# EAGLE board Strampler_redesign_v2_2 (EAGLE 7.3.0)
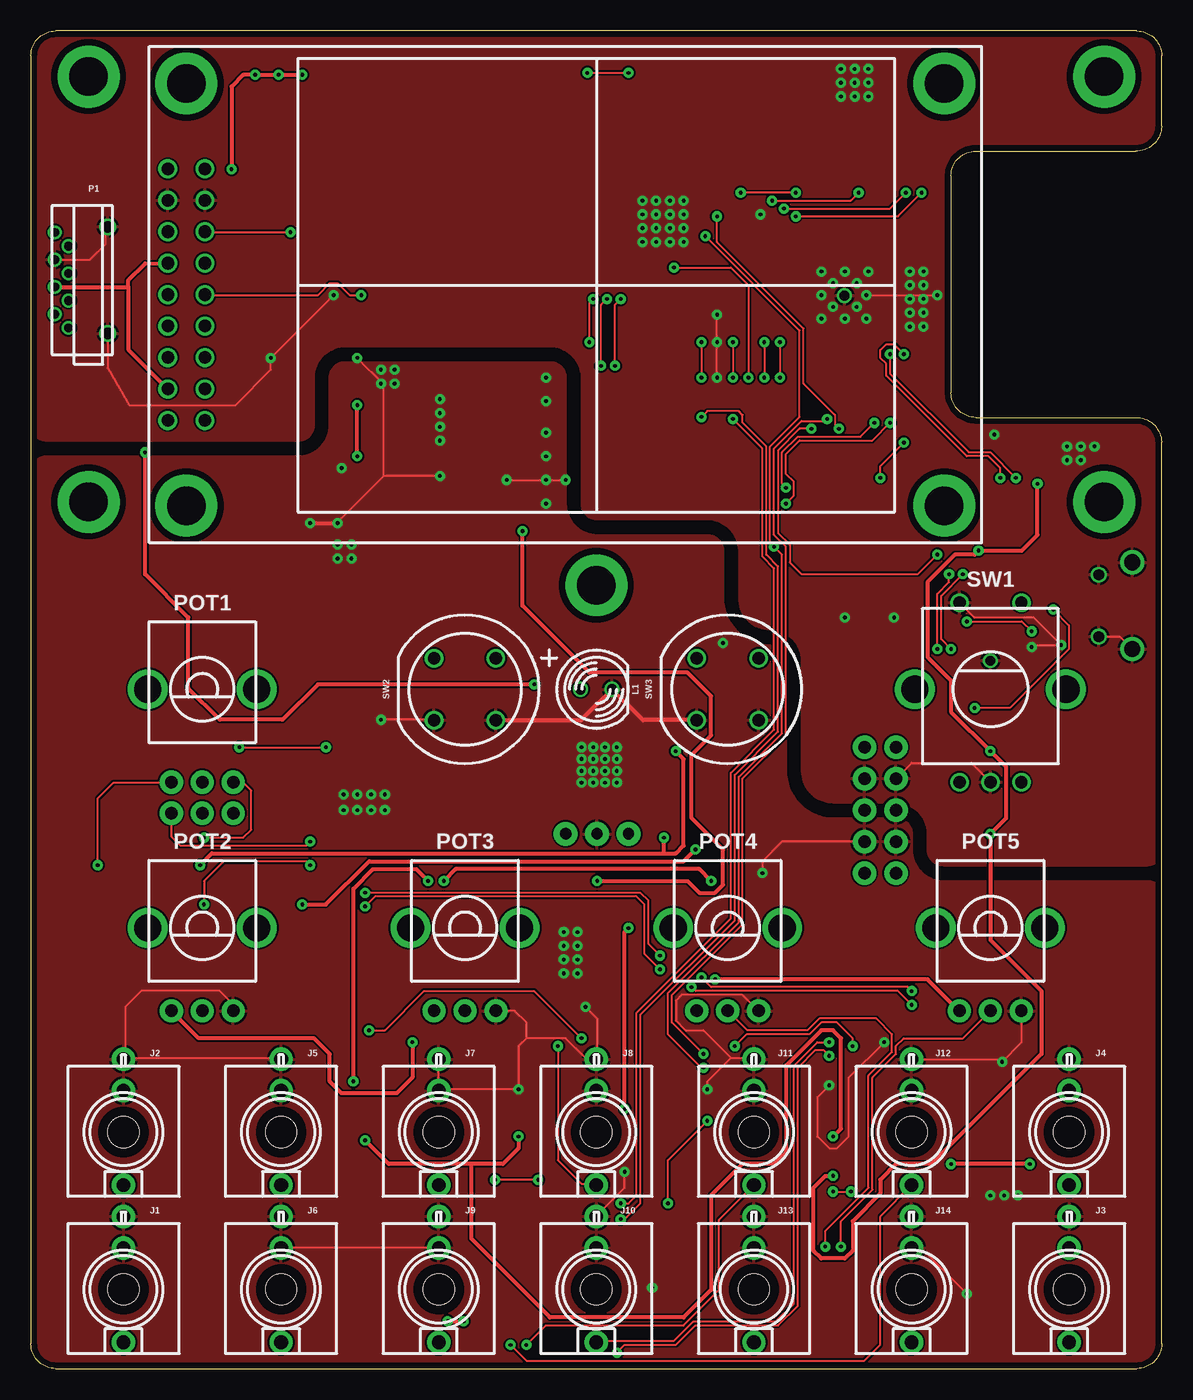
[diagram p2: board, top side]
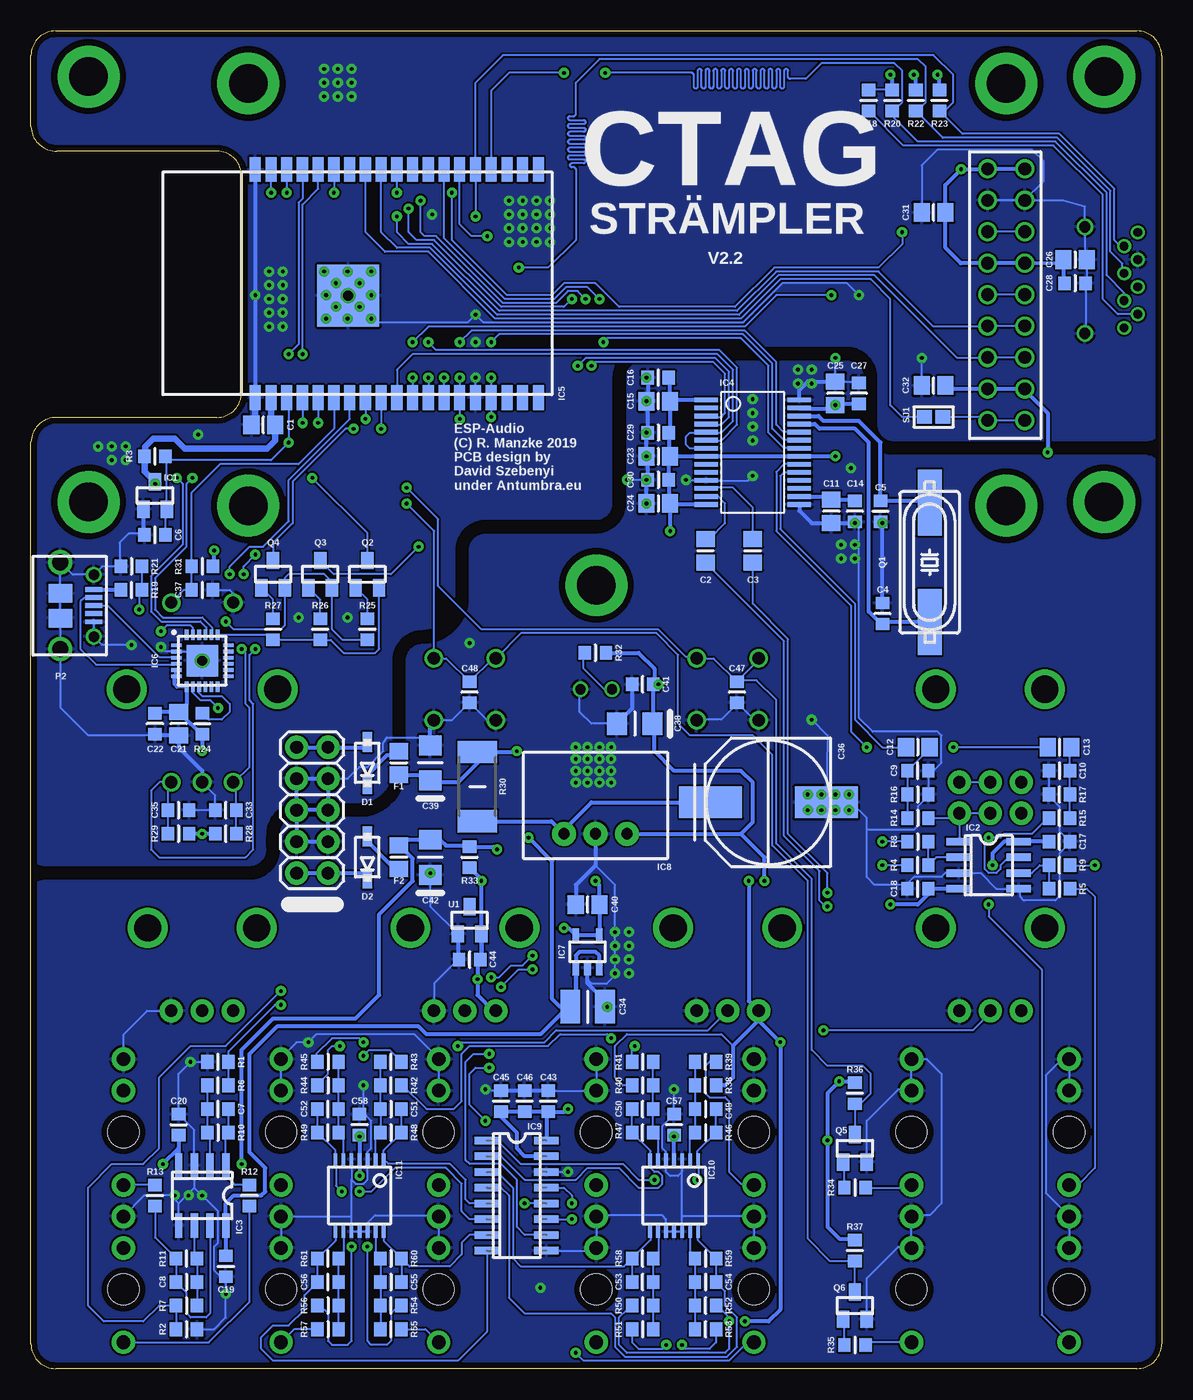
[diagram p3: board, bottom side, seen from below]

Size 91.3 x 108 mm. Coordinates in mm from the lower left corner, seen from the top.
Outline: 2,0 89.3,0 arc90 91.3,2 91.3,74.8 arc90 89.2,76.8 76.3,76.8 arc-90 74.3,78.8 74.3,96.3 arc-90 76.3,98.3 89.2,98.3 arc90 91.3,100.3 91.3,106 arc90 89.3,108 2,108 arc90 0,106 0,2 arc90 2,0
Copper layers (1*16): Top 0.035mm / dielectric 1.5mm / Bottom 0.035mm
Design rules "PCBCart-Standard *": minimum track width 6mil, minimum drill 12mil, track to track 6mil, track to pad 6mil, pad to pad 6mil, via to via 6mil, smd to smd 6mil, copper to edge 20mil, drill to drill 8mil, minimum pad ring 8mil, minimum via ring 10mil, stop-mask expansion 3mil, vias tented up to drill 25mil, thermal gap 8mil

## Footprints (pad centres in the part's own frame; a part is rotated, then mirrored left to right if it is on the bottom)
R0805 = smd 1.3 x 1.5: 1 -0.95,0; 2 0.95,0
RESISTOR_0603 = smd 1 x 1.1: 1 -0.85,0; 2 0.85,0
R1210 = smd 1.6 x 2.7: 1 -1.4,0; 2 1.4,0
PANASONIC_G = smd 5.08 x 2.54: + 4.678,0; - -4.678,0
1206_POL = smd 1.6 x 1.803: 1 -1.422,0; 2 1.422,0
SOD123 = smd 1.6 x 0.8: + 1.7,0; - -1.7,0
PCB_SCREW = drill 3.1 pad 5: P$1 0,0
SOT23 = smd 1 x 1.4: 1 -0.95,-1.1; 2 0.95,-1.1; 3 0,1.1
SOIC8 = smd 0.6 x 2: 1 -1.905,-2.419; 2 -0.635,-2.419; 3 0.635,-2.419; 4 1.905,-2.419; 5 1.905,2.42; 6 0.635,2.42; 7 -0.635,2.42; 8 -1.905,2.42
SSOP28 = smd 0.381 x 1.905: 1 -4.55,-3.752; 2 -3.9,-3.752; 3 -3.25,-3.752; 4 -2.6,-3.752; 5 -1.95,-3.752; 6 -1.3,-3.752; 7 -0.65,-3.752; 8 0,-3.752; 9 0.65,-3.752; 10 1.3,-3.752; 11 1.95,-3.752; 12 2.6,-3.752; 13 3.25,-3.752; 14 3.9,-3.752; 15 3.9,3.752; 16 3.25,3.752; 17 2.6,3.752; 18 1.95,3.752; 19 1.3,3.752; 20 0.65,3.752; 21 0,3.752; 22 -0.65,3.752; 23 -1.3,3.752; 24 -1.95,3.752; 25 -2.6,3.752; 26 -3.25,3.752; 27 -3.9,3.752; 28 -4.55,3.752
ESP32-WROVER-B = smd 5 x 5: GND -1,0.76 | drill 0.8: GND2 -1,0.76 | smd 2 x 0.9: P$1 -9.235,8.26; P$2 -9.235,6.99; P$3 -9.235,5.72; P$4 -9.235,4.45; P$5 -9.235,3.18; P$6 -9.235,1.91; P$7 -9.235,0.64; P$8 -9.235,-0.63; P$9 -9.235,-1.9; P$10 -9.235,-3.17; P$11 -9.235,-4.44; P$12 -9.235,-5.71; P$13 -9.235,-6.98; P$14 -9.235,-8.25; P$15 -9.235,-9.52; P$16 -9.235,-10.79; P$17 -9.235,-12.06; P$18 -9.235,-13.33; P$19 -9.235,-14.6; P$20 9.18,-14.6; P$21 9.18,-13.33; P$22 9.18,-12.06; P$23 9.18,-10.79; P$24 9.18,-9.52; P$25 9.18,-8.25; P$26 9.18,-6.98; P$27 9.18,-5.71; P$28 9.18,-4.44; P$29 9.18,-3.17; P$30 9.18,-1.9; P$31 9.18,-0.63; P$32 9.18,0.64; P$33 9.18,1.91; P$34 9.18,3.18; P$35 9.18,4.45; P$36 9.18,5.72; P$37 9.18,6.99; P$38 9.18,8.26
CP2102N = smd 2.55 x 2.55: GND 0,0 | drill 0.8: GND2 0,0 | smd 0.85 x 0.3: P$1 -2.1,1.25; P$2 -2.1,0.75; P$3 -2.1,0.25; P$4 -2.1,-0.25; P$5 -2.1,-0.75; P$6 -2.1,-1.25; P$13 2.1,-1.25; P$14 2.1,-0.75; P$15 2.1,-0.25; P$16 2.1,0.25; P$17 2.1,0.75; P$18 2.1,1.25 | smd 0.3 x 0.85: P$7 -1.25,-2.1; P$8 -0.75,-2.1; P$9 -0.25,-2.1; P$10 0.25,-2.1; P$11 0.75,-2.1; P$12 1.25,-2.1; P$19 1.25,2.1; P$20 0.75,2.1; P$21 0.25,2.1; P$22 -0.25,2.1; P$23 -0.75,2.1; P$24 -1.25,2.1
SOT23-5L = smd 0.55 x 1.2: 1 -0.95,-1.3; 2 0,-1.3; 3 0.95,-1.3; 4 0.95,1.3; 5 -0.95,1.3
WE78 = drill 0.9 pad 1.93: 1 -2.54,0; 2 0,0; 3 2.54,0
SOIC16 = smd 2 x 0.6: 1 -2.419,4.445; 2 -2.419,3.175; 3 -2.419,1.905; 4 -2.419,0.635; 5 -2.419,-0.635; 6 -2.419,-1.905; 7 -2.419,-3.175; 8 -2.419,-4.445; 9 2.381,-4.445; 10 2.381,-3.175; 11 2.381,-1.905; 12 2.381,-0.635; 13 2.381,0.635; 14 2.381,1.905; 15 2.381,3.175; 16 2.381,4.445
TSSOP14 = smd 0.305 x 0.991: 1 -1.95,-2.918; 2 -1.3,-2.918; 3 -0.65,-2.918; 4 0,-2.918; 5 0.65,-2.918; 6 1.3,-2.918; 7 1.95,-2.918; 8 1.95,2.918; 9 1.3,2.918; 10 0.65,2.918; 11 0,2.918; 12 -0.65,2.918; 13 -1.3,2.918; 14 -1.95,2.918
PROTOJACK = drill 1.1 pad 1.88: GND 0,-5.88; IN 0,4.28; NORM 0,-3.34 | hole 2.5: 0,0
LED_5MM = drill 0.813: A -1.27,0; K 1.27,0
SD-CARD-THONK = drill 0.7: P$1 -3.85,0.47; P$2 -2.75,1.57; P$3 -1.65,0.47; P$4 -0.55,1.57; P$5 0.55,0.47; P$6 1.65,1.57; P$7 2.75,0.47; P$8 3.85,1.57 | drill 0.9: P$9 -4.3,-2.7; P$10 4.3,-2.7
USB-B-MOLEX-1050170001 = smd 0.4 x 1.35: P1 -1.3,0; P2 -0.65,0; P3 0,0; P4 0.65,0; P5 1.3,0 | drill 0.85: P$1 -2.5,0; P$2 2.5,0 | drill 1.3: P$8 3.5,-2.7; P$9 -3.5,-2.7 | smd 1.5 x 1.9: P$10 -1,-2.7; P$11 1,-2.7
MSP2202_DISPLAY = drill 1.016: CS -34.6,4.33; CS1 -31.6,4.33; DC/RS -34.6,-0.75; DC/RS1 -31.6,-0.75; GND -34.6,6.87; GND1 -31.6,6.87; LED -34.6,-8.37; LED1 -31.6,-8.37; RESET -34.6,1.79; RESET1 -31.6,1.79; SCK -34.6,-5.83; SCK1 -31.6,-5.83; SDD/MISO -34.6,-10.91; SDD/MISO1 -31.6,-10.91; SDI/MOSI -34.6,-3.29; SDI/MOSI1 -31.6,-3.29; VCC -34.6,9.41; VCC1 -31.6,9.41 | drill 3.1 pad 5: P$1 -33.1,-17.8; P$2 -33.1,16.3; P$3 28.1,16.3; P$4 28.1,-17.8
POWER_10 = drill 1.016 pad 1.88: 1 -5.08,-1.27; 2 -5.08,1.27; 3 -2.54,-1.27; 4 -2.54,1.27; 5 0,-1.27; 6 0,1.27; 7 2.54,-1.27; 8 2.54,1.27; 9 5.08,-1.27; 10 5.08,1.27
POT_DUAL_THONK = drill 2.2 pad 3.175: P$4 4.4,0; P$5 -4.4,0 | drill 1 pad 1.88: R1_1 -2.5,-10; R1_2 0,-10; R1_3 2.5,-10; R2_1 -2.5,-7.5; R2_2 0,-7.5; R2_3 2.5,-7.5
ALPS_POT_VERTICAL = drill 1 pad 1.88: 1 -2.5,-6.7; 2 0,-6.7; 3 2.5,-6.7 | drill 2.2 pad 3.175: P$4 4.4,0; P$5 -4.4,0
HC49UP = smd 5.334 x 1.93: 1 -4.826,0; 2 4.826,0
R2512 = smd 1.8 x 3.2: 1 -2.8,0; 2 2.8,0
SJ = smd 1.2 x 1.1: 1 -0.75,0; 2 0.75,0
ALPS_EC12E_SW = drill 1: A -2.5,-7.5; B 2.5,-7.5; C 0,-7.5; D -2.5,7; E 2.5,7 | drill 2.2: GND1 -6.1,0; GND2 6.1,0
C&K_TACTILE_SWITCH = drill 1: P$1 -2.5,2.5; P$2 2.5,2.5; P$3 -2.5,-2.5; P$4 2.5,-2.5

## Placement (x,y rotation side)
C1  10uF  [R0805]  72.55,76.2 180 bottom
C2  10uF  [R0805]  36.83,66.04 90 bottom
C3  10uF  [R0805]  33.02,66.04 90 bottom
C4  18pF  [RESISTOR_0603]  22.54,60.96 270 bottom
C5  18pF  [RESISTOR_0603]  22.7,69.22 90 bottom
C6  1uF  [RESISTOR_0603]  81.28,67.31 180 bottom
C7  18pF  [RESISTOR_0603]  76.2,20.95 180 bottom
C8  18pF  [RESISTOR_0603]  78.74,6.99 0 bottom
C9  220pF  [RESISTOR_0603]  19.68,48.26 180 bottom
C10  220pF  [RESISTOR_0603]  8.26,48.26 0 bottom
C11  10uF  [R0805]  26.67,69.22 270 bottom
C12  10uF  [R0805]  19.68,50.16 0 bottom
C13  10uF  [R0805]  8.26,50.16 0 bottom
C14  100nF  [RESISTOR_0603]  24.77,69.22 270 bottom
C15  10uF  [R0805]  40.64,78.11 180 bottom
C16  100nF  [RESISTOR_0603]  40.64,80.01 180 bottom
C17  100nF  [RESISTOR_0603]  8.26,42.55 180 bottom
C18  100nF  [RESISTOR_0603]  19.68,38.73 180 bottom
C19  100nF  [RESISTOR_0603]  75.56,8.26 90 bottom
C20  100nF  [RESISTOR_0603]  79.38,19.68 90 bottom
C21  10uF  [R0805]  79.38,52.07 270 bottom
C22  100nF  [RESISTOR_0603]  81.28,52.07 270 bottom
C23  10uF  [R0805]  40.64,73.66 0 bottom
C24  10uF  [R0805]  40.64,69.85 0 bottom
C25  10uF  [R0805]  26.35,78.74 270 bottom
C26  10uF  [R0805]  6.99,89.53 0 bottom
C27  100nF  [RESISTOR_0603]  24.45,78.74 270 bottom
C28  100nF  [RESISTOR_0603]  6.99,87.63 0 bottom
C29  100nF  [RESISTOR_0603]  40.64,75.56 0 bottom
C30  100nF  [RESISTOR_0603]  40.64,71.75 0 bottom
C31  10uF  [R0805]  18.41,93.34 180 bottom
C32  10uF  [R0805]  18.41,79.38 180 bottom
C33  100nF  [RESISTOR_0603]  75.56,45.09 180 bottom
C34  10uF  [R1210]  46.35,29.21 0 bottom
C35  100nF  [RESISTOR_0603]  79.38,45.09 0 bottom
C36  1000uF  [PANASONIC_G]  31.75,45.72 180 bottom
C37  100nF  [RESISTOR_0603]  77.47,62.87 0 bottom
C38  22uF  [1206_POL]  42.55,52.07 0 bottom
C39  22uF  [1206_POL]  59.05,48.9 270 bottom
C40  10uF  [R0805]  46.35,37.47 180 bottom
C41  100nF  [RESISTOR_0603]  41.91,55.24 180 bottom
C42  22uF  [1206_POL]  59.05,41.27 270 bottom
C43  1uF  [RESISTOR_0603]  49.53,21.59 270 bottom
C44  100nF  [RESISTOR_0603]  55.88,33.02 180 bottom
C45  1uF  [RESISTOR_0603]  53.34,21.59 270 bottom
C46  100nF  [RESISTOR_0603]  51.44,21.59 270 bottom
C47  100nF  [RESISTOR_0603]  34.29,54.61 270 bottom
C48  100nF  [RESISTOR_0603]  55.88,54.61 270 bottom
C49  1nF  [RESISTOR_0603]  36.83,20.95 0 bottom
C50  1nF  [RESISTOR_0603]  41.91,20.95 180 bottom
C51  1nF  [RESISTOR_0603]  62.23,20.95 0 bottom
C52  1nF  [RESISTOR_0603]  67.31,20.95 180 bottom
C53  1nF  [RESISTOR_0603]  41.91,6.99 180 bottom
C54  1nF  [RESISTOR_0603]  36.83,6.99 0 bottom
C55  1nF  [RESISTOR_0603]  62.23,6.99 0 bottom
C56  1nF  [RESISTOR_0603]  67.31,6.99 180 bottom
C57  100nF  [RESISTOR_0603]  39.37,19.68 270 bottom
C58  100nF  [RESISTOR_0603]  64.77,19.68 270 bottom
D1  [SOD123]  64.14,48.9 90 bottom
D2  [SOD123]  64.14,41.27 90 bottom
F1  FERRITE-BEAD0805  [R0805]  61.59,48.9 90 bottom
F2  FERRITE-BEAD0805  [R0805]  61.59,41.27 270 bottom
H1  PCB_SCREW  [PCB_SCREW]  86.65,104.31 0 top
H2  PCB_SCREW  [PCB_SCREW]  45.65,63.24 0 top
H3  PCB_SCREW  [PCB_SCREW]  4.65,69.97 0 top
H4  PCB_SCREW  [PCB_SCREW]  86.65,69.97 0 top
H5  PCB_SCREW  [PCB_SCREW]  4.65,104.31 0 top
IC1  MIC803  [SOT23]  81.28,70.48 0 bottom
IC2  TL072  [SOIC8]  13.97,40.64 270 bottom
IC3  TL072  [SOIC8]  77.47,13.97 180 bottom
IC4  WM8731  [SSOP28]  33.02,73.66 270 bottom
IC5  ESP32-WROVER-B  [ESP32-WROVER-B]  64.93,87.63 90 bottom
IC6  CP2102N  [CP2102N]  77.47,57.15 0 bottom
IC7  ADP7118  [SOT23-5L]  46.35,33.66 0 bottom
IC8  WE173950378  [WE78]  45.72,43.18 0 bottom
IC9  MCP3208  [SOIC16]  52.07,13.97 0 bottom
IC10  MCP6004  [TSSOP14]  39.37,13.97 180 bottom
IC11  MCP6004  [TSSOP14]  64.77,13.97 180 bottom
J1  THONKICONN  [PROTOJACK]  7.47,6.4 180 top
J2  THONKICONN  [PROTOJACK]  7.47,19.1 180 top
J3  THONKICONN  [PROTOJACK]  83.83,6.4 180 top
J4  THONKICONN  [PROTOJACK]  83.83,19.1 180 top
J5  THONKICONN  [PROTOJACK]  20.2,19.1 180 top
J6  THONKICONN  [PROTOJACK]  20.2,6.4 180 top
J7  THONKICONN  [PROTOJACK]  32.92,19.1 180 top
J8  THONKICONN  [PROTOJACK]  45.65,19.1 180 top
J9  THONKICONN  [PROTOJACK]  32.92,6.4 180 top
J10  THONKICONN  [PROTOJACK]  45.65,6.4 180 top
J11  THONKICONN  [PROTOJACK]  58.38,19.1 180 top
J12  THONKICONN  [PROTOJACK]  71.11,19.1 180 top
J13  THONKICONN  [PROTOJACK]  58.38,6.4 180 top
J14  THONKICONN  [PROTOJACK]  71.11,6.4 180 top
L1  LED5MM  [LED_5MM]  45.65,54.85 0 top
P1  SD-CARD  [SD-CARD-THONK]  3.49,87.88 90 top
P2  USB-B  [USB-B-MOLEX-1050170001]  86.22,61.59 270 bottom
P3  MSP2202_DISPLAY  [MSP2202_DISPLAY]  45.65,87.46 0 top
P4  POWER_SIMPLE10  [POWER_10]  68.58,45.09 90 bottom
POT1  [POT_DUAL_THONK]  13.83,54.85 0 top
POT2  [ALPS_POT_VERTICAL]  13.83,35.58 0 top
POT3  [ALPS_POT_VERTICAL]  35.05,35.58 0 top
POT4  [ALPS_POT_VERTICAL]  56.26,35.58 0 top
POT5  [ALPS_POT_VERTICAL]  77.47,35.58 0 top
Q1  [HC49UP]  18.73,65.09 90 bottom
Q2  SS8050-G  [SOT23]  64.14,64.14 0 bottom
Q3  SS8050-G  [SOT23]  67.94,64.14 0 bottom
Q4  SS8050-G  [SOT23]  71.75,64.14 0 bottom
Q5  SS8050-G  [SOT23]  24.77,17.78 0 bottom
Q6  SS8050-G  [SOT23]  24.77,5.08 0 bottom
R1  39k  [RESISTOR_0603]  76.2,24.77 180 bottom
R2  39k  [RESISTOR_0603]  78.74,3.17 0 bottom
R3  10k  [RESISTOR_0603]  81.28,73.66 180 bottom
R4  22k  [RESISTOR_0603]  19.68,40.64 180 bottom
R5  22k  [RESISTOR_0603]  8.26,38.73 0 bottom
R6  5.6k  [RESISTOR_0603]  76.2,22.86 180 bottom
R7  5.6k  [RESISTOR_0603]  78.74,5.08 0 bottom
R8  3.3k  [RESISTOR_0603]  19.68,42.55 0 bottom
R9  3.3k  [RESISTOR_0603]  8.26,40.64 180 bottom
R10  39k  [RESISTOR_0603]  76.2,19.05 0 bottom
R11  39k  [RESISTOR_0603]  78.74,8.89 180 bottom
R12  1k  [RESISTOR_0603]  73.66,13.97 270 bottom
R13  1k  [RESISTOR_0603]  81.28,13.97 90 bottom
R14  5.6k  [RESISTOR_0603]  19.68,44.45 0 bottom
R15  5.6k  [RESISTOR_0603]  8.26,44.45 180 bottom
R16  5.6k  [RESISTOR_0603]  19.68,46.35 0 bottom
R17  5.6k  [RESISTOR_0603]  8.26,46.35 180 bottom
R18  10k  [RESISTOR_0603]  23.65,102.39 90 bottom
R19  22.1k  [RESISTOR_0603]  83.19,62.87 180 bottom
R20  10k  [RESISTOR_0603]  21.75,102.39 90 bottom
R21  47.5k  [RESISTOR_0603]  83.19,64.77 0 bottom
R22  10k  [RESISTOR_0603]  19.84,102.39 90 bottom
R23  10k  [RESISTOR_0603]  17.94,102.39 90 bottom
R24  10k  [RESISTOR_0603]  77.47,52.07 90 bottom
R25  10k  [RESISTOR_0603]  64.14,59.69 270 bottom
R26  10k  [RESISTOR_0603]  67.94,59.69 270 bottom
R27  10k  [RESISTOR_0603]  71.75,59.69 270 bottom
R28  10k  [RESISTOR_0603]  75.56,43.18 180 bottom
R29  10k  [RESISTOR_0603]  79.38,43.18 0 bottom
R30  10  [R2512]  55.24,46.99 90 bottom
R31  10k  [RESISTOR_0603]  77.47,64.77 0 bottom
R32  68  [RESISTOR_0603]  45.72,57.78 0 bottom
R33  220  [RESISTOR_0603]  55.88,41.27 90 bottom
R34  100k  [RESISTOR_0603]  24.77,14.61 0 bottom
R35  100k  [RESISTOR_0603]  24.77,1.91 0 bottom
R36  10k  [RESISTOR_0603]  24.77,22.23 270 bottom
R37  10k  [RESISTOR_0603]  24.77,9.53 270 bottom
R38  180k  [RESISTOR_0603]  36.83,22.86 180 bottom
R39  100k  [RESISTOR_0603]  36.83,24.77 180 bottom
R40  180k  [RESISTOR_0603]  41.91,22.86 0 bottom
R41  100k  [RESISTOR_0603]  41.91,24.77 0 bottom
R42  200k  [RESISTOR_0603]  62.23,22.86 180 bottom
R43  100k  [RESISTOR_0603]  62.23,24.77 180 bottom
R44  200k  [RESISTOR_0603]  67.31,22.86 0 bottom
R45  100k  [RESISTOR_0603]  67.31,24.77 0 bottom
R46  47k  [RESISTOR_0603]  36.83,19.05 0 bottom
R47  47k  [RESISTOR_0603]  41.91,19.05 180 bottom
R48  66.5k  [RESISTOR_0603]  62.23,19.05 0 bottom
R49  66.5k  [RESISTOR_0603]  67.31,19.05 180 bottom
R50  200k  [RESISTOR_0603]  41.91,5.08 0 bottom
R51  100k  [RESISTOR_0603]  41.91,3.17 0 bottom
R52  200k  [RESISTOR_0603]  36.83,5.08 180 bottom
R53  100k  [RESISTOR_0603]  36.83,3.17 180 bottom
R54  200k  [RESISTOR_0603]  62.23,5.08 180 bottom
R55  100k  [RESISTOR_0603]  62.23,3.17 180 bottom
R56  200k  [RESISTOR_0603]  67.31,5.08 0 bottom
R57  100k  [RESISTOR_0603]  67.31,3.17 0 bottom
R58  33k  [RESISTOR_0603]  41.91,8.89 180 bottom
R59  33k  [RESISTOR_0603]  36.83,8.89 0 bottom
R60  66.5k  [RESISTOR_0603]  62.23,8.89 0 bottom
R61  66.5k  [RESISTOR_0603]  67.31,8.89 180 bottom
SJ1  [SJ]  18.41,76.83 180 bottom
SW1  ENCODER  [ALPS_EC12E_SW]  77.47,54.85 0 top
SW2  C&K_TACTILE_SWITCH  [C&K_TACTILE_SWITCH]  35.05,54.85 0 top
SW3  C&K_TACTILE_SWITCH  [C&K_TACTILE_SWITCH]  56.26,54.85 0 top
U1  LM4040SOT23  [SOT23]  55.88,36.2 0 bottom

## Tracks (layer width: path | path; a pad name or v marks a point on that pad's centre or on a via)
+3.3VA  (via drill 0.3)
  Top 0.305: v26.35,73.66 C25.2 | v47.94,20.95 47.94,35.24 v48.26,35.56 | v45.72,39.37 53.02,39.37 53.98,38.42 55.24,38.42 55.88,39.05 55.88,41.91 53.34,44.45 53.34,49.53 54.93,51.12 54.93,54.29 53.02,56.2 45.09,56.2 39.69,61.59 v39.69,67.63
  Bottom 0.305: C43.2 49.69,20.74 | 49.69,20.74 IC9.16 | IC9.15 51.44,17.14 52.07,17.78 52.07,19.05 53.34,20.32 C45.2 C43.2 | 49.69,20.74 C46.2 | C27.2 26.57,77.89 C25.2 | C25.2 26.67,77.79 26.67,77.47 | 26.67,77.47 28.89,77.47 | 28.89,77.47 29.18,77.47 IC4.27 28.98,77.56 28.89,77.47 | IC4.1 39.59,78.21 C15.1 | C15.1 39.69,79.91 C16.1 | C15.1 39.69,75.67 C29.2 39.79,73.76 C23.2 | C23.2 IC4.8 IC4.21 v26.35,73.66 | C23.2 39.79,73.56 C30.2 39.79,69.95 C24.2 | IC4.14 39.6,69.76 C24.2 | 26.67,77.47 C25.2 | C25.2 26.04,77.47 | C25.2 | C43.2 48.16,20.74 v47.94,20.95 | v48.26,35.56 47.91,35.56 IC7.5 IC7.4 C40.1 45.41,39.05 v45.72,39.37 | C24.2 v39.69,67.63
  other vias: 26.35,77.79
+3V3  (via drill 0.3)
  Top 0.305: P1.P$4 7.86,87.33 | 7.86,87.33 7.86,87.87 9.21,89.22 P3.RESET | 7.86,87.33 7.86,82.28 P3.LED | v21.91,104.46 v20,104.46 v18.1,104.46 17.14,104.46 16.19,103.5 v16.19,96.84 | v39.37,18.73 39.37,17.78 38.1,16.51 35.56,16.51 | 35.56,16.51 28.89,16.51 v26.99,18.41 | v64.77,18.73 65.41,19.37 65.41,26.67 64.77,27.3 63.82,27.3 60.96,24.45 60.96,17.46 60.01,16.51 57.47,16.51 54.93,13.97 54.93,6.35 52.7,4.13 41.91,4.13 35.56,10.48 35.56,16.51 | v26.04,23.18 26.04,38.73 27.62,40.32 31.11,40.32 v32.07,39.37 | v81.28,71.44 81.28,67.31 80.01,66.04 v76.52,66.04 76.2,65.72 74.61,65.72 72.39,63.5 72.39,57.47 74.3,55.56 74.3,53.02 v77.47,49.85 78.74,48.58 78.74,44.45 v77.47,43.18 77.47,34.61 81.6,30.48 81.6,25.4 72.71,16.51 69.85,16.51 68.58,15.24 68.58,14.13 66.36,11.91 66.36,9.53 65.72,8.89 63.82,8.89 63.18,9.53 63.18,14.61 64.14,15.56 v64.77,15.56 | v40.64,55.24 23.18,55.24 20.32,52.39 15.24,52.39 12.7,54.93 12.7,60.64 9.21,64.14 v9.21,73.98
  Bottom 0.152: R20.2 R18.2
  Bottom 0.305: C28.1 7.93,87.73 C26.1 8.48,89.22 P3.RESET P3.RESET1 16.23,89.25 17.46,90.49 C31.1 17.46,95.56 v16.19,96.84 13.62,96.84 P3.VCC1 P3.VCC | C32.1 17.18,79.09 P3.LED1 P3.LED 11.05,79 9.21,77.15 v9.21,73.98 | R20.2 21.75,104.3 v21.91,104.46 | R22.2 19.84,104.3 v20,104.46 | R23.2 17.94,104.3 v18.1,104.46 | IC10.4 v39.37,18.73 C57.2 | R37.1 24.87,10.48 26.04,10.48 26.99,11.43 v26.99,18.41 26.99,22.23 v26.04,23.18 24.87,23.18 R36.1 | R32.2 42.23,57.78 40.96,56.52 40.96,55.56 | 40.96,55.56 40.96,55.35 C41.1 41.06,52.13 C38.2 40.96,51.9 40.96,49.85 39.37,48.26 33.97,48.26 33.02,47.31 33.02,44.13 33.97,43.18 | IC8.3 33.97,43.18 | R29.2 v77.47,43.18 R28.2 | C21.1 78.72,53.67 IC6.P$7 79.5,55.05 79.69,55.24 79.69,55.78 IC6.P$6 IC6.P$5 | C21.1 81.18,53.02 C22.1 | C21.1 78.42,52.07 77.57,51.22 R24.1 v77.47,49.85 | C58.2 v64.77,18.73 IC11.4 v64.77,15.56 | v32.07,39.37 32.07,41.27 33.97,43.18 | R31.2 76.62,64.98 76.52,65.09 v76.52,66.04 | IC1.3 v81.28,71.44 | 40.96,55.56 v40.64,55.24
  Bottom 0.508: IC5.P$2 71.92,76.52 | 71.92,76.52 C1.1 | IC1.3 82.13,72.44 R3.2 82.07,73.72 82.07,74.45 81.44,75.09 79.69,75.09 78.9,74.3 72.23,74.3 71.6,74.93 71.6,76.04 71.92,76.36 71.92,76.52
+12V  (via drill 0.3)
  Top 0.305: v13.65,40.64 14.61,41.59 51.12,41.59 | 51.12,41.59 52.07,41.59 52.7,42.23 52.7,49.21 v52.07,49.85 | 51.12,41.59 v51.12,42.86
  Bottom 0.305: C17.2 IC2.8 | 11.75,42.55 IC2.8 | IC2.8 12.7,42.55 13.65,41.59 v13.65,40.64 | IC7.1 47.31,30.16 47.76,29.71 C34.1 48.58,29.21 49.21,29.84 49.21,40.96 v51.12,42.86 | IC7.3 45.41,33.34 45.72,33.66 46.99,33.66 47.31,33.34 IC7.1 | v52.07,49.85 52.13,49.79 R30.2 55.24,48.9 56.83,47.31 58.89,47.31 C39.2 59.53,47.95 F1.1 | IC7.1 47.3,29.85 50.16,26.99 59.37,26.99 60.01,27.62 71.44,27.62 73.66,25.4 73.66,17.46 72.39,16.19 72.39,14.29 72.71,13.97 74.93,13.97 75.56,13.34 IC3.8 C19.2
-10V  (via drill 0.3)
  Top 0.305: v33.66,3.81 v34.92,3.81 | v54.93,39.37 53.98,40.32 34.29,40.32 v33.34,39.37 | POT5.1 74.94,28.88 72.39,31.43 v55.24,31.43 | v30.8,26.35 30.8,23.5 29.53,22.23 25.08,22.23 24.13,23.18 24.13,25.4 22.86,26.67 13.55,26.67 POT2.1
  Bottom 0.152: R52.1 35.88,5.08 34.92,4.13 v34.92,3.81 34.92,1.59 35.24,1.27 43.18,1.27 43.81,1.91 43.81,4.13 43.18,4.76 43.08,4.76 R50.1 42.86,5.08 | R40.1 43.5,22.86 44.13,23.5 44.13,26.04 43.18,26.99 35.56,26.99 34.61,26.04 | POT3.1 32.55,28.1
  Bottom 0.305: R38.1 35.24,22.86 34.61,23.5 34.61,26.04 32.55,28.1 | C44.1 54.93,33.12 U1.2 54.93,39.48 R33.1 | POT4.1 53.98,28.89 55.24,30.16 v55.24,31.43 55.24,33.02 C44.1 | v33.66,3.81 31.75,3.81 30.8,4.76 v30.8,26.35 32.55,28.1 POT3.1 33.34,29.67 v33.34,39.37 | C44.1 55.03,33.23 54.93,33.34 v54.93,39.37
-12V  (via drill 0.3)
  Top 0.305: v21.91,37.47 23.81,37.47 27.3,40.96 52.7,40.96 v53.66,41.91 | v80.64,16.51 v74.3,16.51
  Bottom 0.152: F2.1 61.59,42.39
  Bottom 0.305: IC2.4 C18.1 18.84,38.31 19.68,37.47 v21.91,37.47 | F2.1 61.02,42.7 C42.1 58.26,42.7 57.78,42.23 55.98,42.23 R33.2 53.87,42.12 v53.66,41.91 | IC3.4 C20.1 79.38,17.78 v80.64,16.51 | v74.3,16.51 74.3,25.72 71.75,28.26 65.09,28.26 63.18,30.16 63.18,36.67 60.48,39.37 60.48,41.17 61.59,42.28 61.59,42.39
CVIN0  (via drill 0.3)
  Top 0.152: v40.96,15.24 v37.47,15.24
  Bottom 0.152: C49.2 R46.2 37.47,17.57 37.47,16.83 37.42,16.87 IC10.1 37.42,15.29 v37.47,15.24 | IC9.1 53.66,18.41 51.75,16.51 43.5,16.51 42.23,15.24 v40.96,15.24
CVIN1
  Bottom 0.152: C50.2 R47.2 41.27,17.57 41.27,16.83 41.32,16.87 IC10.7 41.27,16.84 41.27,16.19 40.96,15.88 40.64,15.88 40.32,15.56 40.32,14.92 40.64,14.61 42.23,14.61 43.81,16.19 46.35,16.19 47.31,15.24 51.44,15.24 53.34,17.14 IC9.2
CVIN2
  Bottom 0.152: IC10.8 41.32,11.07 41.27,11.11 41.27,10.38 R58.2 | R58.2 C53.2 | IC9.3 53.66,15.88 52.39,14.61 52.39,8.89 51.75,8.26 43.4,8.26 R58.2
CVIN3
  Bottom 0.152: IC10.14 37.42,10.84 37.47,10.79 37.47,10.38 R59.2 C54.2 35.24,6.25 35.24,5.08 34.29,4.13 34.29,1.75 35.08,0.95 43.34,0.95 44.13,1.75 44.13,4.13 44.45,4.45 51.44,4.45 52.7,5.71 52.7,13.97 53.34,14.61 IC9.4
CVIN4
  Bottom 0.152: C51.2 R48.2 62.82,17.61 IC11.1 62.44,16.51 57.47,16.51 56.2,15.24 56.2,13.65 55.88,13.34 IC9.5
CVIN5  (via drill 0.3)
  Top 0.152: v64.77,14.29 v66.2,14.29
  Bottom 0.152: C52.2 R49.2 66.72,17.61 IC11.7 66.72,16.87 66.67,16.83 66.67,14.76 v66.2,14.29 | IC9.6 55.88,12.06 56.52,12.7 56.52,14.92 57.78,16.19 61.91,16.19 63.82,14.29 v64.77,14.29
CVIN6
  Bottom 0.152: IC11.14 62.82,10.33 R60.2 | R60.2 C55.2 | IC9.7 55.88,10.79 56.52,10.16 56.52,9.21 57.47,8.26 60.74,8.26 R60.2
CVIN7
  Bottom 0.152: IC11.8 66.72,10.33 R61.2 C56.2 69.22,5.93 69.22,4.76 70.48,3.49 71.75,3.49 72.71,2.54 72.71,1.59 71.75,0.64 56.83,0.64 54.49,2.98 IC9.8
D+
  Bottom 0.152: P2.P3 85.09,61.59 80.96,57.47 79.64,57.47 IC6.P$3
D-
  Bottom 0.152: P2.P2 86.06,62.24 86.04,62.23 87,62.23 87.31,61.91 87.31,58.1 86.04,56.83 79.64,56.83 IC6.P$4
DTR  (via drill 0.3)
  Top 0.152: v75.56,60.33 80.01,60.33 v80.8,59.53
  Bottom 0.152: R25.2 66.14,58.84 66.99,59.69 Q3.2 67,63.5 67.63,64.14 70.48,64.14 70.8,63.82 Q4.2 70.81,60.01 71.12,59.69 74.93,59.69 v75.56,60.33 | IC6.P$23 78.22,59.8 78.42,60.01 80.33,60.01 v80.8,59.53
EN  (via drill 0.3)
  Top 0.152: v68.58,71.91 68.58,72.87 v70.48,74.77
  Bottom 0.152: C6.1 80.43,69.28 IC1.2 80.33,73.56 R3.1 80.11,73.34 71.91,73.34 v70.48,74.77 70.48,77.47 70.65,77.63 IC5.P$3 | Q2.3 64.14,67.47 v68.58,71.91
GND  (via drill 0.3)
  Top 0.152: P1.P$6 4.76,89.53 6.03,90.81 6.03,92.02 P1.P$10 | P1.P$9 6.19,80.8 7.94,77.79 16.51,77.79 19.37,80.64 v19.37,81.6 v24.45,86.68 | v33.02,72.07 28.47,72.07 | 28.47,72.07 C14.2 v24.77,68.26 | 28.47,72.07 28.47,79.48 v26.35,81.6 | J7.GND J7.NORM 33.03,22.54 v39.37,22.54 39.37,26.04 40.01,26.67 | P2.P$2 87.92,59.09 P2.P$8 | J10.GND 45.65,12.31 47.94,14.61 v47.94,15.88 | J9.NORM J6.NORM | v38.42,71.75 v43.18,71.75 | J14.NORM 71.86,9.74 v75.56,6.03 | POT5.3 79.97,26.32 v78.42,24.77 78.21,24.98 J12.GND | v64.45,22.86 63.5,21.91 63.5,18.73 64.45,17.78 65.09,17.78 66.04,18.73 66.04,23.5 v68.9,26.35 | POT4.3 58.75,28.88 57.47,30.16 52.55,30.16 52.07,29.69 52.07,28.1 52.86,27.3 54.29,27.3 56.52,25.08 | 56.52,25.08 58.27,25.08 J11.GND | 40.01,26.67 43.18,26.67 44.77,25.08 45.4,25.08 45.51,24.98 J8.GND 45.72,25.05 45.72,28.26 v44.77,29.21 | 40.01,26.67 40.01,27.94 39.05,28.89 37.56,28.89 POT3.3 | P4.8 71.12,48.9 75.92,48.9 SW1.C | P4.3 60.64,42.55 59.05,40.96 v59.05,40.01 | v80.8,58.26 80.96,58.42 v83.19,58.42 80.96,60.64 76.18,60.64 SW1.D | v55.4,80.01 v55.4,85.09 | SW2.P$3 32.43,52.35 32.38,52.39 v28.26,52.39 | 7.62,25.13 7.62,29.21 8.89,30.48 15.24,30.48 16.19,29.53 | 7.62,25.13 J2.GND | 16.19,29.53 16.19,28.89 POT2.3 16.33,29.39 16.19,29.53 | 7.62,25.13 7.62,25.08 20.09,25.08 J5.GND | v54.61,22.54 54.61,23.18 56.52,25.08 | v67.47,86.68 v73.19,86.68
  Top 0.305: v22.54,68.26 v24.77,68.26 | SW2.P$4 44.42,52.35 L1.K 49.42,52.35 SW3.P$3
  Bottom 0.152: P1.P$9 6.13,83.64 C28.2 6.04,87.73 C26.2 6.19,89.69 P1.P$10 6.19,93.82 7.94,94.3 11.02,94.3 P3.GND P3.GND1 11.08,94.33 9.53,95.89 9.53,97.47 10.48,98.42 18.1,98.42 19.37,97.16 C31.2 | C27.1 24.86,79.69 C25.1 v26.35,81.6 | v33.02,72.07 33.38,71.71 IC4.11 38.37,71.71 v38.42,71.75 | C10.1 R17.2 9.11,46.25 8.26,45.4 8.26,43.4 C17.1 7.41,42.44 8.26,41.59 8.26,38.1 8.57,37.78 11.11,37.78 11.43,38.1 11.43,38.62 IC2.5 13.34,38.73 14.61,40.01 IC2.3 17.46,40.01 17.78,39.69 20,39.69 20.54,39.16 | C18.2 20.54,39.16 | 20.54,39.16 20.64,39.05 23.18,39.05 23.81,39.69 23.81,43.5 | 23.81,43.5 23.81,44.45 25.08,45.72 C36.- 26.99,51.12 v28.26,52.39 | 23.81,43.5 20,43.5 19.68,43.81 19.68,45.4 18.84,46.25 R16.2 C9.1 18.41,48.26 17.78,48.9 17.78,51.12 18.1,51.44 23.34,51.44 24.45,52.55 24.45,67.94 v24.77,68.26 | 38.72,12.38 IC10.12 IC10.11 IC10.10 40.02,11.41 40.01,11.43 40.01,12.06 40.32,12.38 45.54,12.38 J10.GND J10.NORM 45.86,9.53 IC9.9 | 38.72,12.38 IC10.3 38.72,15.89 39.05,15.56 39.69,15.56 40.01,15.88 40.01,16.87 IC10.5 40.02,17.48 40.32,17.78 40.32,19.58 C57.1 v39.37,22.54 | Q6.2 23.82,7.3 21.27,9.84 20.3,9.84 J6.NORM J6.GND 20.09,12.38 18.73,12.38 17.78,13.34 17.78,23.81 18.94,24.98 19.9,24.98 | Q5.2 23.82,20 21.27,22.54 20.3,22.54 J5.NORM J5.GND 19.9,24.98 | SW2.P$3 32.88,52.35 C47.2 34.29,53.66 35.56,52.39 37.51,52.39 SW2.P$4 | SW3.P$3 54.47,52.35 C48.2 57.29,52.35 SW3.P$4 | C38.1 46.04,52.07 46.99,53.02 46.99,54.78 L1.K | C43.1 J8.NORM J8.GND | J13.NORM J13.GND 58.49,12.38 63.5,12.38 64.12,11.76 IC11.12 IC11.11 IC11.10 65.42,12.38 | 65.42,12.38 65.42,15.26
  Bottom 0.152: IC11.5 65.42,15.26 | 65.42,15.26 65.09,14.92 64.45,14.92 64.14,15.24 64.14,16.87 IC11.3 64.12,17.48 63.82,17.78 63.82,20 64.45,20.64 | 65.42,12.38 65.53,12.28 J14.GND J14.NORM | J12.NORM J12.GND | 78.11,14.61 IC3.3 78.11,19.27 C20.2 79.38,23.81 v78.42,24.77 R1.2 | 78.11,14.61 79.38,13.34 | R2.2 76.52,3.17 75.56,4.13 v75.56,6.03 C19.1 75.98,7.41 76.52,7.94 76.52,9.84 76.2,10.16 76.2,12.7 78.11,14.61 | IC3.5 79.38,13.34 | 79.38,13.34 80.01,13.97 82.14,13.97 J3.GND | C35.2 C33.2 76.42,46.29 SW1.C | P2.P5 P2.P$2 85.55,58.42 v83.19,58.42 | 82.23,67.41 83.4,67.41 84.14,66.67 84.14,64.87 R21.1 85.55,64.77 P2.P$1 87.92,64.09 P2.P$9 P2.P$10 P2.P$11 P2.P$8 88.9,58.07 88.9,53.34 86.68,51.12 C21.2 | 78.11,57.47 78.54,57.9 IC6.P$2 80.44,57.9 v80.8,58.26 | IC9.14 v47.94,15.88 | 38.72,12.38 38.61,12.28 J9.GND J9.NORM | J2.NORM J2.GND 8.04,24.98 9.37,23.65 9.37,14.17 J1.GND J1.NORM | J11.NORM J11.GND 58.38,25.04 60.33,26.99 68.26,26.99 v68.9,26.35 69.85,26.35 71.12,25.08 | J4.GND 83.83,26.98 81.92,28.89 79.98,28.89 POT5.3 | C30.1 v43.18,71.75 | C58.1 64.56,20.54 64.45,20.64 | 64.45,20.64 v64.45,22.86 | C44.2 56.83,33.02 58.74,31.11 58.74,28.91 POT4.3 | U1.1 59.05,37.32 C42.2 v59.05,40.01 | C34.2 v44.77,29.21 | P4.7 65.72,47.62 64.77,48.58 64.14,48.58 62.87,49.85 62.87,50.48 62.55,50.96 59.54,50.96 C39.1 | C37.2 75.25,62.87 74.93,62.55 74.93,61.89 SW1.D | IC5.P$15 v55.41,80 v55.4,80.01 | 63.51,84.45 56.04,84.45 v55.4,85.09 54.77,84.45 33.81,84.45 30.64,87.63 25.4,87.63 v24.45,86.68 | 63.51,84.45 IC5.GND | 19.9,24.98 20,25.08 | IC7.2 46.35,31.43 46.04,31.11 44.77,31.11 44.13,31.75 44.13,39.05 45.72,40.64
  Bottom 0.152: C45.1 54.51,22.44 v54.61,22.54 | C32.2 v19.36,81.59 v19.37,81.6 | 63.51,84.45 63.66,84.45 65.88,86.68 v67.47,86.68
  Bottom 0.305: C43.1 C46.1 C45.1 | IC1.1 82.23,67.41 C6.2 | 73.18,75.89 C1.2 | IC4.28 29.27,79 28.57,79.69 26.67,79.69 C25.1 | IC4.15 29.27,69.27 28.26,68.26 C11.2 24.86,68.27 C14.2 v24.77,68.26 | C4.1 v22.54,68.26 C5.1 | C24.1 41.59,71.66 C30.1 41.49,73.56 C23.1 41.59,75.47 C29.1 41.49,78 C15.2 41.49,78.2 C16.2 | C41.2 42.76,53.28 C38.1 | C39.1 59.05,52.05 SW3.P$4 | IC8.2 45.72,40.64 47.31,39.05 C40.2 | C34.2 44.95,29.71 46.35,31.11 IC7.2 | P4.5 P4.7 P4.8 P4.6 | P4.6 P4.4 P4.3 P4.5 | P4.5 P4.6 | C22.2 81.18,51.12 C21.2 79.38,50.16 77.47,48.26 SW1.C | IC6.GND2 77.79,57.15 78.11,57.47 78.42,57.78 | U1.1 56.83,33.12 C44.2 | IC5.P$38 IC5.P$1
  Bottom 0.508: IC5.P$1 73.19,76.51 C1.2
  other vias: 63.82,88.58 65.72,88.58 67.63,88.58 63.82,86.68 63.82,84.77 65.72,84.77 67.47,84.77 66.67,85.72 64.77,85.72 64.77,87.63 66.67,87.63 50.16,6.51 44.45,47.31 45.4,47.31 46.35,47.31 47.31,47.31 47.31,48.26 46.35,48.26 45.4,48.26 44.45,48.26 44.45,49.21 45.4,49.21 46.35,49.21 47.31,49.21 44.45,50.16 45.4,50.16 46.35,50.16 47.31,50.16 25.24,45.09 25.24,46.35 26.35,46.35 26.35,45.09 27.46,45.09 27.46,46.35 28.57,46.35 28.57,45.09 55.88,58.58 43.02,31.91 44.13,31.91 44.13,33.02 43.02,33.02 43.02,34.13 44.13,34.13 43.02,35.24 44.13,35.24 77.47,13.97 78.58,13.97 79.69,13.97 52.7,94.3 52.7,93.19 52.7,92.08 52.7,90.96 51.59,90.96 51.59,92.08 51.59,93.19 51.59,94.3 50.48,94.3 50.48,93.19 50.48,92.08 50.48,90.96 49.37,90.96 49.37,92.08 49.37,93.19 49.37,94.3 70.96,88.58 70.96,87.47 70.96,86.36 70.96,85.25 70.96,84.14 72.07,84.14 72.07,85.25 72.07,86.36 72.07,87.47 72.07,88.58 66.52,102.71 67.63,102.71 67.63,103.82 66.52,103.82 65.41,103.82 65.41,102.71 65.41,104.93 66.52,104.93 67.63,104.93 83.66,74.45 84.77,74.45 85.88,74.45 83.66,73.34 84.77,73.34 77.79,75.41 69.69,60.64 65.72,60.64 55.4,82.87 33.02,74.93 41.59,69.85 41.59,71.75 41.59,73.66 41.59,75.56 41.59,78.11 41.59,80.01 33.02,76.04 33.02,77.15 33.02,78.26 28.26,79.53 28.26,80.64 29.37,80.64 29.37,79.53 24.77,66.52 25.88,66.52 25.88,65.41 24.77,65.41 58.9,93.19 25.08,72.71
  pour Bottom: 1.27,107.95 arc90 0,106.68 0,76.2 arc90 1.27,74.93 21.59,74.93 arc90 22.86,76.2 22.86,80.01 arc-90 25.4,82.55 41.91,82.55 arc-90 44.45,80.01 44.45,69.85 arc90 45.72,68.58 54.61,68.58 arc-90 57.15,66.04 57.15,62.23 arc90 59.69,59.69 arc-90 62.23,57.15 62.23,48.26 arc90 64.77,45.72 69.85,45.72 arc-90 72.39,43.18 arc-14 72.39,41.91 arc90 73.66,40.64 90.17,40.64 arc90 91.44,41.91 91.44,106.68 arc90 90.17,107.95
  pour Bottom: 0,2.54 0,72.39 arc-90 1.27,73.66 21.59,73.66 arc90 24.13,76.2 24.13,80.01 arc-90 25.4,81.28 41.91,81.28 arc-90 43.18,80.01 43.18,69.85 arc90 45.72,67.31 54.61,67.31 arc-90 55.88,66.04 55.88,62.23 arc90 59.69,58.42 arc-90 60.96,57.15 60.96,48.26 arc90 64.77,44.45 69.85,44.45 arc-90 71.12,43.18 71.12,41.91 arc90 73.66,39.37 90.17,39.37 arc-90 91.44,38.1 91.44,2.54 arc-90 88.9,0 2.54,0 arc-90
  pour Top: 0,106.68 0,76.2 arc90 1.27,74.93 21.59,74.93 arc90 22.86,76.2 22.86,80.01 arc-90 25.4,82.55 41.91,82.55 arc-90 44.45,80.01 44.45,69.85 arc90 45.72,68.58 54.61,68.58 arc-90 57.15,66.04 57.15,62.23 arc90 59.69,59.69 arc-90 62.23,57.15 62.23,48.26 arc90 64.77,45.72 69.85,45.72 arc-90 72.39,43.18 72.39,41.91 arc90 73.66,40.64 90.17,40.64 arc90 91.44,41.91 91.44,106.68 arc90 90.17,107.95 1.27,107.95 arc90
  pour Top: 0,72.39 arc-90 1.27,73.66 21.59,73.66 arc90 24.13,76.2 24.13,80.01 arc-90 25.4,81.28 41.91,81.28 arc-90 43.18,80.01 43.18,69.85 arc90 45.72,67.31 54.61,67.31 arc-90 55.88,66.04 55.88,62.23 arc90 59.69,58.42 arc-90 60.96,57.15 60.96,48.26 arc90 64.77,44.45 69.85,44.45 arc-90 71.12,43.18 71.12,41.91 arc90 73.66,39.37 90.17,39.37 arc-90 91.44,38.1 91.44,2.54 arc-90 88.9,0 2.54,0 arc-90 0,2.54
IO0  (via drill 0.3)
  Top 0.152: v51.44,13.34 51.44,16.83 v54.61,20 | v54.29,24.29 54.13,24.29 51.44,26.99 51.44,30.32 57.15,36.04 57.15,47.78 60.64,51.28 60.64,65.72 v60.01,66.36 59.69,66.67 59.69,74.45 62.07,76.83 62.07,83.82 v54.45,91.44
  Bottom 0.152: IC9.12 v51.44,13.34 | v54.61,20 55.88,21.27 55.88,23.81 55.4,24.29 v54.29,24.29 | v60.01,66.36 62.23,64.14 66.84,64.14 Q3.3 | v54.45,91.44 55.72,91.44 56.67,92.39 IC5.P$25
IO2  (via drill 0.3)
  Top 0.152: v55.4,93.03 55.4,90.96 62.39,83.98 62.39,79.53 64.93,76.99 64.93,76.2 v65.25,75.88
  Bottom 0.152: P1.P$7 3.02,90.65 3.17,90.81 3.49,90.81 3.81,91.12 3.81,95.25 8.26,99.69 16.09,99.69 R23.1 17.52,101.54 16.83,102.23 16.83,104.46 18.41,106.05 53.18,106.05 55.41,103.82 IC5.P$24 | IC5.P$24 v55.41,93.03 v55.4,93.03 | IC5.P$24 | v65.25,75.88 65.88,75.88 70.17,71.6 70.17,68.26 71.75,66.67 Q4.3
IO4  (via drill 0.3)
  Top 0.152: v45.09,82.87 45.09,86.04 v45.4,86.36
  Bottom 0.152: IC4.22 30.5,74.31 31.75,75.56 31.75,80.96 33.97,83.19 44.77,83.19 v45.09,82.87 | v45.4,86.36 46.35,87.31 48.1,87.31 49.05,86.36 53.02,86.36 57.94,91.28 IC5.P$26
IO5  (via drill 0.3)
  Top 0.152: P3.CS1 13.62,91.79 13.65,91.76 v20.95,91.76 | v61.75,94.93 v57.31,94.93
  Bottom 0.152: P3.CS P3.CS1 | v20.95,91.76 20.95,90.81 22.86,88.9 31.27,88.9 34.45,85.72 43.81,85.72 45.72,87.63 48.26,87.63 49.21,86.68 52.86,86.68 57.31,91.12 v57.31,94.93 | IC5.P$29 v61.76,94.94 v61.75,94.93
IO12  (via drill 0.3)
  Top 0.152: v47.62,13.34 48.26,13.34 48.9,13.97 48.9,28.73 56.52,36.35 56.52,48.1 60.01,51.59 60.01,64.61 59.05,65.56 59.05,74.3 v56.67,76.68 | v56.67,82.87 v56.67,80.01
  Bottom 0.152: IC4.24 30.52,75.61 31.11,76.2 31.11,81.28 33.66,83.82 55.72,83.82 v56.67,82.87 | IC9.13 48.26,14.61 47.62,13.97 v47.62,13.34 | v56.67,80.01 IC5.P$14 v56.68,76.68 v56.67,76.68
IO13  (via drill 0.3)
  Top 0.152: v47.62,12.06 47.94,12.06 49.21,13.34 49.21,28.57 56.83,36.2 56.83,47.94 60.33,51.44 60.33,64.77 59.37,65.72 59.37,74.45 57.47,76.36 57.47,76.99 57.15,77.31 54.61,77.31 v54.13,76.83 | v54.13,82.87 v54.13,80.01
  Bottom 0.152: IC4.23 30.51,74.96 31.43,75.88 31.43,81.12 33.81,83.5 53.5,83.5 v54.13,82.87 | IC9.11 v47.62,12.06 | v54.13,80.01 IC5.P$16 v54.14,76.84 v54.13,76.83
IO14  (via drill 0.3)
  Top 0.152: v51.91,88.9 56.52,88.9 57.94,87.47 v57.94,80.01
  Bottom 0.152: P1.P$5 3.17,88.58 3.17,89.22 4.13,90.17 4.13,95.09 8.41,99.38 17.68,99.38 R22.1 19.74,101.54 19.05,102.23 19.05,105.09 19.68,105.73 45.4,105.73 47.31,103.82 47.31,101.28 arc90 47.47,101.12 47.78,101.12 arc-90 47.94,100.97 arc-90 47.78,100.81 46.67,100.81 arc90 46.51,100.65 arc90 46.67,100.49 47.78,100.49 arc-90 47.94,100.33 arc-90 47.78,100.17 46.67,100.17 arc90 46.51,100.01 arc90 46.67,99.85 47.78,99.85 arc-90 47.94,99.69 arc-90 47.78,99.54 46.67,99.54 arc90 46.51,99.38 arc90 46.67,99.22 47.78,99.22 arc-90 47.94,99.06 arc-90 47.78,98.9 46.67,98.9 arc90 46.51,98.74 arc90 46.67,98.58 47.78,98.58 arc-90 47.94,98.42 arc-90 47.78,98.27 46.67,98.27 arc90 46.51,98.11 arc90 46.67,97.95 47.78,97.95 arc-90 47.94,97.79 arc-90 47.78,97.63 46.67,97.63 arc90 46.51,97.47 arc90 46.67,97.31 47.62,97.31 arc-90 47.78,97.16 arc-90 47.62,97 47.47,97 arc90 47.31,96.84 47.31,91.12 49.53,88.9 v51.91,88.9 | IC5.P$13 v57.95,80 v57.94,80.01
IO15  (via drill 0.3)
  Top 0.152: v44.93,104.62 v48.26,104.62
  Bottom 0.152: P1.P$3 3.02,86.84 4.45,88.27 4.45,94.93 8.57,99.06 19.68,99.06 21.59,100.97 21.59,101.39 R20.1 21.65,101.54 20.95,102.23 20.95,104.78 21.59,105.41 27.46,105.41 28.73,104.14 30,104.14 arc90 30.16,104.3 30.16,104.78 arc-90 30.32,104.93 arc-90 30.48,104.78 30.48,103.5 arc90 30.64,103.35 arc90 30.8,103.5 30.8,104.78 arc-90 30.96,104.93 arc-90 31.11,104.78 31.11,103.5 arc90 31.27,103.35 arc90 31.43,103.5 31.43,104.78 arc-90 31.59,104.93 arc-90 31.75,104.78 31.75,103.5 arc90 31.91,103.35 arc90 32.07,103.5 32.07,104.78 arc-90 32.23,104.93 arc-90 32.38,104.78 32.38,103.5 arc90 32.54,103.35 arc90 32.7,103.5 32.7,104.78 arc-90 32.86,104.93 arc-90 33.02,104.78 33.02,103.5 arc90 33.18,103.35 arc90 33.34,103.5 33.34,104.78 arc-90 33.5,104.93 arc-90 33.66,104.78 33.66,103.5 arc90 33.81,103.35 arc90 33.97,103.5 33.97,104.78 arc-90 34.13,104.93 arc-90 34.29,104.78 34.29,103.5 arc90 34.45,103.35 arc90 34.61,103.5 34.61,104.78 arc-90 34.77,104.93 arc-90 34.92,104.78 34.92,103.5 arc90 35.08,103.35 arc90 35.24,103.5 35.24,104.78 arc-90 35.4,104.93 arc-90 35.56,104.78 35.56,103.5 arc90 35.72,103.35 arc90 35.88,103.5 35.88,104.78 arc-90 36.04,104.93 arc-90 36.2,104.78 36.2,103.5 arc90 36.35,103.35 arc90 36.51,103.5 36.51,104.78 arc-90 36.67,104.93 arc-90 36.83,104.78 36.83,103.5 arc90 36.99,103.35 arc90 37.15,103.5 37.15,104.78 arc-90 37.31,104.93 arc-90 37.47,104.78 37.47,103.5 arc90 37.62,103.35 arc90 37.78,103.5 37.78,104.46 arc-90 37.94,104.62 v44.93,104.62 | v48.26,104.62 52.7,104.62 54.13,103.19 IC5.P$23
IO18
  Bottom 0.152: P3.SCK P3.SCK1 13.37,81.63 13.34,81.6 16.51,81.6 23.18,88.27 30.96,88.27 34.13,85.09 53.66,85.09 59.05,90.49 61.75,90.49 63.02,91.76 IC5.P$30
IO19
  Bottom 0.152: SJ1.2 20.95,76.83 21.91,77.79 21.91,86.36 23.5,87.95 30.8,87.95 33.97,84.77 53.82,84.77 59.21,90.17 62.71,90.17 64.29,91.76 IC5.P$31
IO21  (via drill 0.3)
  Top 0.152: v46.04,80.96 46.04,85.88 v46.51,86.36 | v59.85,94.3 66.2,94.3 v66.83,94.93
  Bottom 0.152: IC4.3 36.77,76.89 36.83,76.83 35.56,76.83 35.24,77.15 35.24,80.33 36.2,81.28 45.72,81.28 v46.04,80.96 | v46.51,86.36 47.15,87 47.94,87 48.9,86.04 53.18,86.04 58.58,91.44 59.53,91.44 59.85,91.76 v59.85,94.3 | IC5.P$33 v66.84,94.94 v66.83,94.93
IO22  (via drill 0.3)
  Top 0.152: v47.15,80.96 47.15,85.88 v47.62,86.36 | v60.8,93.66 69.37,93.66 v70.64,94.93
  Bottom 0.152: IC4.4 36.26,76.26 36.2,76.2 35.56,76.2 34.92,76.83 34.92,80.49 36.04,81.6 46.51,81.6 v47.15,80.96 | v47.62,86.36 48.26,85.72 53.34,85.72 58.74,91.12 60.17,91.12 60.8,91.76 v60.8,93.66 | IC5.P$36 v70.65,94.94 v70.64,94.93
IO23  (via drill 0.3)
  Top 0.152: v61.75,93.03 70.01,93.03 v71.91,94.93
  Bottom 0.152: P3.SDI/MOSI P3.SDI/MOSI1 13.62,84.17 13.65,84.14 18.41,84.14 22.86,88.58 31.11,88.58 34.29,85.41 53.5,85.41 58.9,90.81 60.8,90.81 61.75,91.76 v61.75,93.03 | IC5.P$37 71.92,95.25 v71.91,94.93
IO25
  Bottom 0.152: IC4.7 37.13,74.31 37.15,74.3 38.1,74.3 38.42,74.61 38.42,75.25 38.1,75.56 36.82,75.56 | 36.82,75.56 IC4.5 | 36.82,75.56 35.56,75.56 34.61,76.52 34.61,80.64 35.88,81.92 60.48,81.92 61.75,80.64 IC5.P$10
IO26  (via drill 0.3)
  Top 0.152: P3.DC/RS1 13.62,86.71 13.65,86.68 23.18,86.68 24.13,87.63 24.77,87.63 25.72,86.68 v26.67,86.68 | v60.48,82.87 v60.48,80.01
  Bottom 0.152: P3.DC/RS P3.DC/RS1 | v26.67,86.68 31.11,86.68 33.66,84.14 59.21,84.14 v60.48,82.87 | v60.48,80.01 IC5.P$11
IO27  (via drill 0.3)
  Top 0.152: v59.21,82.87 v59.21,80.01
  Bottom 0.152: IC4.6 36.23,74.96 36.2,74.93 35.56,74.93 34.29,76.2 34.29,80.8 35.72,82.23 58.58,82.23 v59.21,82.87 | v59.21,80.01 IC5.P$12
IO32  (via drill 0.3)
  Top 0.152: v54.29,25.4 51.75,27.94 51.75,30.16 57.47,35.88 57.47,47.62 60.96,51.12 60.96,66.36 60.01,67.31 60.01,74.3 62.23,76.52 64.14,76.52 v64.29,76.68
  Bottom 0.152: IC9.10 51.44,10.79 52.07,11.43 52.07,15.24 53.34,16.51 55.88,16.51 56.2,16.83 56.2,24.77 55.56,25.4 v54.29,25.4 | IC5.P$8 64.3,76.84 v64.29,76.68
IO33  (via drill 0.3)
  Top 0.152: v73.18,58.1 73.18,62.55 74.14,63.5 v74.14,64.14 | v63.02,75.88 62.07,75.88 60.33,74.14 60.33,67.47 61.28,66.52 61.28,65.09 62.23,64.14 71.6,64.14 v73.18,65.72
  Bottom 0.152: R29.1 C35.1 80.22,47.09 SW1.B 80.92,47.35 81.6,46.67 81.6,41.91 80.96,41.27 73.98,41.27 73.34,41.91 73.34,53.66 73.66,53.98 73.66,57.63 v73.18,58.1 | v74.14,64.14 74.14,64.77 v73.18,65.72 | IC5.P$9 v63.03,75.89 v63.02,75.88
IO34
  Bottom 0.152: SW1.E 78.95,62.87 C37.1 R31.1 78.32,70.75 76.04,73.03 69.69,73.03 66.84,75.88 IC5.P$6
IO35  (via drill 0.3)
  Top 0.152: v74.3,58.1 73.5,58.9 73.5,62.39 v75.25,64.14
  Bottom 0.152: R28.1 C33.1 74.72,47.09 SW1.A 74.89,47.35 73.66,48.58 73.66,53.34 73.98,53.66 73.98,57.78 v74.3,58.1 | v75.25,64.14 75.25,64.77 73.66,66.36 72.55,66.36 70.48,68.42 70.48,71.75 65.56,76.68 IC5.P$7
LIN  (via drill 0.3)
  Top 0.152: v16.83,50.16 v23.81,50.16
  Bottom 0.152: IC4.20 30.5,73.01 31.11,72.39 31.11,67.63 25.08,61.59 25.08,51.44 v23.81,50.16 | C13.1 v16.83,50.16
LOUT
  Bottom 0.152: C3.2 33.02,69.53 34.61,71.12 36.71,71.12 IC4.12
N$1
  Bottom 0.152: R24.2 76.94,52.39 75.88,52.39 75.25,53.02 75.25,53.66 75.88,54.29 77.47,54.29 77.79,54.61 77.79,54.93 77.72,54.99 IC6.P$9
N$2  (via drill 0.3)
  Top 0.152: v82.55,61.28 83.82,60.01 83.82,58.1 79.06,53.34 v76.2,53.34
  Bottom 0.152: R21.2 R19.1 82.55,62.87 v82.55,61.28 | v76.2,53.34 76.83,53.98 77.63,53.98 78.26,54.61 78.26,55.09 IC6.P$8
N$3
  Bottom 0.152: R25.1 64.14,62.09 Q2.1
N$4
  Bottom 0.305: P2.P1 84.06,62.9 R19.2
N$5
  Bottom 0.152: P1.P$2 3.53,85.13 4.76,86.36 4.76,94.77 8.73,98.74 20.85,98.74 R18.1
N$6
  Bottom 0.152: R26.1 67.94,62.09 Q3.1
N$7
  Bottom 0.152: P3.SDD/MISO P3.SDD/MISO1 13.62,76.55 13.65,76.52 13.97,76.83 SJ1.1
N$8
  Bottom 0.152: R34.2 20.41,14.61 J5.IN
N$9
  Bottom 0.152: R27.1 71.75,62.09 Q4.1
N$10
  Bottom 0.152: J6.IN 23.7,2.12 R35.2
N$11
  Bottom 0.152: R34.1 25.61,16.58 Q5.1
N$12
  Bottom 0.152: R35.1 25.61,3.88 Q6.1
N$13
  Bottom 0.152: R39.1 36.51,24.77 36.83,24.45 36.83,22.23 36.51,21.91 35.24,21.91 34.92,21.59 34.92,15.88 33.97,14.92 33.03,14.92 J7.IN
N$14  (via drill 0.3)
  Top 0.152: v40.01,1.91 41.59,3.49 52.7,3.49 55.56,6.35 55.56,12 J11.IN
  Bottom 0.152: R51.1 42.76,2.12 42.23,1.59 40.32,1.59 v40.01,1.91
N$15
  Bottom 0.152: IC10.9 40.67,10.82 40.64,10.79 40.64,9.31 R58.1 C53.1 R50.2 R51.2
N$16  (via drill 0.3)
  Top 0.152: v42.55,26.04 42.55,16.83 44.45,14.92 45.54,14.92 J8.IN
  Bottom 0.152: R41.1 42.76,25.82 v42.55,26.04
N$17
  Bottom 0.152: IC10.2 38.07,16.86 38.1,16.83 38.1,18.63 R46.1 C49.1 R38.2 R39.2
N$18  (via drill 0.3)
  Top 0.152: v66.36,26.04 66.36,26.67 65.09,27.94 63.82,27.94 62.87,26.99 57.78,26.99 v56.83,26.04
  Bottom 0.152: R44.1 68.16,22.96 67.31,23.81 67.31,25.72 66.99,26.04 v66.36,26.04 | v56.83,26.04 56.52,26.35 49.85,26.35 48.9,27.3 36.63,27.3 POT3.2
N$19
  Bottom 0.152: IC10.6 40.67,16.86 40.64,16.83 40.64,18.63 R47.1 C50.1 R40.2 R41.2
N$20  (via drill 0.3)
  Top 0.152: v38.73,1.91 40.01,0.64 67.31,0.64 68.58,1.91 68.58,12.29 J12.IN
  Bottom 0.152: R53.1 35.98,2.12 36.51,1.59 38.42,1.59 v38.73,1.91
N$21
  Bottom 0.152: R53.2 R52.2 C54.1 R59.1 38.1,9.31 38.1,10.79 38.07,10.82 IC10.13
N$22  (via drill 0.3)
  Top 0.152: v27.3,27.3 28.57,27.3 31.75,30.48 40.64,30.48 v44.45,26.67
  Bottom 0.152: R42.1 61.28,22.86 59.37,20.95 57.15,20.95 56.52,21.59 56.52,25.4 55.88,26.04 49.53,26.04 48.58,26.99 44.77,26.99 v44.45,26.67 | POT2.2 13.83,28.71 15.24,27.3 v27.3,27.3
N$23  (via drill 0.3)
  Top 0.152: v47.31,1.27 47.94,1.91 52.07,1.91 53.66,3.49 60.33,3.49 61.91,5.08 61.91,24.29 63.34,25.72 63.98,25.72 v64.45,25.24
  Bottom 0.152: J9.IN 33.44,2.12 34.92,0.64 46.67,0.64 v47.31,1.27 | v64.45,25.24 63.98,25.72 62.33,25.72 R43.1
N$24
  Bottom 0.152: IC11.2 63.47,18.66 R48.1 C51.1 R42.2 R43.2
N$25
  Bottom 0.152: R55.1 59.44,3.17 J13.IN
N$26
  Bottom 0.152: IC11.13 63.47,9.28 R60.1 C55.1 R54.2 R55.2
N$27  (via drill 0.3)
  Top 0.152: J10.IN 45.65,2.15 45.72,2.22 51.91,2.22 53.5,3.81 60.17,3.81 61.59,5.24 61.59,24.45 63.5,26.35 v64.45,26.35
  Bottom 0.152: v64.45,26.35 64.77,26.67 66.99,26.67 68.26,25.4 68.26,24.87 R45.1
N$28
  Bottom 0.152: IC11.6 66.07,18.66 R49.1 C52.1 R44.2 R45.2
N$29
  Bottom 0.152: R57.1 70.05,3.17 J14.IN
N$30
  Bottom 0.152: R57.2 R56.2 C56.1 R61.1 66.07,9.28 IC11.9
N$31  (via drill 0.3)
  Top 0.152: v22.54,40.64 22.23,40.96 15.56,40.96 13.97,39.37 v13.97,37.47
  Bottom 0.152: R4.2 v22.54,40.64 | v13.97,37.47 13.97,36.51 9.68,32.23 9.68,4.33 J1.IN
N$32
  Bottom 0.152: IC2.2 18.2,41.27 R4.1 R8.2
N$33
  Bottom 0.305: P4.10 P4.9 64.56,50.16 D1.+
N$34  (via drill 0.3)
  Top 0.152: POT1.R1_1 11.33,42.96 12.06,42.23 22.23,42.23 v22.54,42.55
  Bottom 0.152: R8.1 v22.54,42.55
N$35  (via drill 0.3)
  Top 0.152: v65.41,9.84 65.41,11.91 67.94,14.45 67.94,23.5 69.85,25.4 69.85,26.04 70.48,26.67 75.26,26.67 POT5.2
  Bottom 0.152: R56.1 67.94,5.08 67.31,4.45 67.31,2.22 66.99,1.91 65.72,1.91 65.41,2.22 v65.41,9.84
N$36
  Bottom 0.152: R14.2 16.73,44.45 POT1.R1_3 | POT1.R1_3 16.33,42.6 IC2.1 | POT1.R1_3 POT1.R1_2
N$37
  Bottom 0.152: C12.2 18.73,50.06 C9.2 R16.1 R14.1
N$38  (via drill 0.3)
  Top 0.152: v64.14,9.84 64.14,11.11 67.63,14.61 67.63,23.65 69.53,25.56 69.53,26.99 68.26,28.26 63.66,28.26 62.71,27.3 57.84,27.3 POT4.2
  Bottom 0.152: R54.1 61.59,5.08 62.23,4.45 62.23,2.22 62.55,1.91 63.82,1.91 64.14,2.22 v64.14,9.84
N$39
  Bottom 0.152: R5.2 6.03,38.73 5.4,38.1 5.4,16.19 6.67,14.92 7.36,14.92 J2.IN
N$40
  Bottom 0.152: IC2.6 10.48,40.01 9.84,40.64 R9.2 R5.1
N$41  (via drill 0.3)
  Top 0.152: v5.4,40.64 5.4,46.04 6.67,47.31 11.29,47.31 POT1.R2_1
  Bottom 0.152: R9.1 v5.4,40.64
N$42  (via drill 0.3)
  Top 0.152: v13.97,42.86 17.14,42.86 17.78,43.5 17.78,46.67 17.14,47.31 16.37,47.31 POT1.R2_3
  Bottom 0.152: POT1.R2_3 POT1.R2_2 13.69,47.35 13.65,47.31 | R15.2 9.21,44.45 10.48,43.18 12.7,43.18 13.02,42.86 v13.97,42.86 14.29,42.55 14.29,40.32 13.97,40.01 13.34,40.01 13.02,40.32 13.02,40.64 12.38,41.27 IC2.7 10.79,41.27
N$43
  Bottom 0.305: Q1.2 18.4,70.06 C5.2 22.7,74.77 24.45,76.52 27.3,76.52 27.7,76.91 IC4.26
N$44
  Bottom 0.305: Q1.1 22.07,60.27 C4.2 22.64,60.11 23.65,61.12 23.65,74.77 24.77,75.88 27.62,75.88 28,76.26 IC4.25
N$45
  Bottom 0.152: R15.1 R17.1 C10.2 7.41,50.06 C13.2
N$46
  Bottom 0.152: C7.1 R10.2 75.56,18.84 IC3.1 75.56,15.56 74.83,14.82 R12.1
N$47
  Bottom 0.305: D1.- 64.14,47.94 62.55,49.53 61.81,49.53 F1.2
N$48
  Bottom 0.152: IC3.2 76.83,18.84 R10.1 C7.2 R6.2
N$49  (via drill 0.3)
  Top 0.152: v71.12,29.37 70.01,30.48 53.66,30.48 v53.34,30.8 | v50.8,32.23 49.53,33.5 49.53,37.47 48.9,38.1 27.78,38.1 v26.99,37.31
  Bottom 0.152: R6.1 R1.1 75.35,25.61 71.6,29.37 v71.12,29.37 | v53.34,30.8 51.91,32.23 v50.8,32.23 | v26.99,37.31 27.15,37.31 27.62,37.78 27.62,40.16 30.48,43.02 30.48,58.74 C2.1
N$50
  Bottom 0.305: R30.1 49.27,44.19 IC8.1 48.26,43.5 46.04,45.72 C36.+ | C36.+ 36.2,45.72 35.88,45.4 36.11,45.4 C36.+
N$52
  Bottom 0.152: J3.IN 76.94,2.12 73.66,5.4 R12.2
N$53
  Bottom 0.305: P4.2 P4.1 64.56,40.01 D2.-
N$54
  Bottom 0.152: IC3.7 76.83,4.45 77.15,4.13 78.42,4.13 78.74,4.45 78.74,6.13 C8.1 R11.2 81.28,10.58 R13.1
N$55
  Bottom 0.152: IC3.6 78.11,9.11 R11.1 C8.2 R7.2
N$56
  Bottom 0.305: IC4.16 26.91,70.41 C11.1 24.86,70.17 C14.1
N$57  (via drill 0.3)
  Top 0.152: v71.12,30.48 70.8,30.8 54.93,30.8 v54.13,31.59 | v50.8,33.34 49.85,34.29 49.85,37.78 49.21,38.42 v26.99,38.42
  Bottom 0.152: R2.1 R7.1 80.96,5.08 82.23,3.81 85.41,3.81 86.68,5.08 86.68,14.61 84.77,16.51 82.23,16.51 80.96,17.78 80.96,23.5 78.42,26.04 75.56,26.04 v71.12,30.48 | v54.13,31.59 53.5,31.59 52.55,32.54 51.59,32.54 v50.8,33.34 | v26.99,38.42 26.99,40.01 30.16,43.18 30.16,58.9 33.02,61.75 C3.1
N$58
  Bottom 0.152: R13.2 J4.IN
N$59
  Bottom 0.305: D2.+ 64.14,42.55 62.23,40.64 61.81,40.64 F2.2
N$60
  Bottom 0.152: L1.A 45,54.85 46.67,56.52 46.67,57.68 R32.1
RIN
  Bottom 0.152: IC4.19 30.51,72.36 30.8,72.07 30.8,67.79 24.77,61.75 24.77,52.39 22.54,50.16 C12.1
ROUT
  Bottom 0.152: C2.2 36.52,66.99 35.24,68.26 35.24,69.85 35.88,70.48 36.7,70.48 IC4.13
RTS
  Bottom 0.152: IC6.P$19 72.17,59.25 R27.2 R26.2 67.09,58.84 66.04,57.78 63.5,57.78 63.18,58.1 Q2.2
RXD  (via drill 0.3)
  Top 0.152: v69.37,81.92 69.37,80.33 75.72,73.98 77.47,73.98 v79.53,71.91
  Bottom 0.152: v69.37,81.92 69.37,93.98 68.1,95.25 IC5.P$34 | IC6.P$21 77.15,59.32 77.15,59.85 77.63,60.33 80.8,60.33 81.6,61.12 81.6,63.98 79.06,66.52 79.06,71.44 v79.53,71.91
TXD  (via drill 0.3)
  Top 0.152: v78.26,71.91 78.26,72.71 77.31,73.66 75.56,73.66 69.06,80.17 69.06,81.12 68.58,81.6 68.58,82.23 69.06,82.71 69.69,82.71 v70.48,81.92
  Bottom 0.152: IC6.P$20 76.68,59.29 76.68,59.85 77.47,60.64 80.64,60.64 81.28,61.28 81.28,63.82 78.74,66.36 78.74,71.44 v78.26,71.91 | IC5.P$35 69.38,94.45 69.69,94.14 69.69,82.71 v70.48,81.92
VN_IO39  (via drill 0.3)
  Top 0.152: v60.96,71.12 60.64,71.44 60.64,73.98 61.91,75.25 66.99,75.25 v68.1,76.36
  Bottom 0.152: Q5.3 R36.2 24.34,21.38 23.5,22.23 23.5,23.81 24.13,24.45 26.99,24.45 28.26,25.72 28.26,39.53 31.11,42.39 31.11,53.98 32.7,55.56 34.19,55.56 C47.1 | SW2.P$1 32.55,57.2 C47.1 | C47.1 36.18,57.35 SW2.P$2 37.66,57.35 37.78,57.47 38.42,57.47 40.64,59.69 54.93,59.69 58.42,63.18 58.42,68.58 v60.96,71.12 | IC5.P$5 v68.11,76.36 v68.1,76.36
VP_IO36  (via drill 0.3)
  Top 0.152: v60.96,69.85 61.59,70.48 61.59,71.6 60.96,72.23 60.96,73.82 62.07,74.93 67.94,74.93 v69.37,76.36
  Bottom 0.152: Q6.3 R37.2 26.77,8.68 28.57,10.48 28.57,39.37 31.43,42.23 31.43,49.53 33.02,51.12 38.1,51.12 39.05,52.07 39.05,57.63 40.8,59.37 51.73,59.37 SW3.P$1 53.99,57.35 C48.1 57.77,57.35 58.54,57.35 | SW3.P$2 58.54,57.35 | 58.54,57.35 58.74,57.78 58.74,67.63 v60.96,69.85 | IC5.P$4 v69.38,76.36 v69.37,76.36

## Text on the board
bPlace: CTAG | STRÄMPLER | V2.2 | ESP-Audio / (C) R. Manzke 2019 / PCB design by / David Szebenyi / under Antumbra.eu